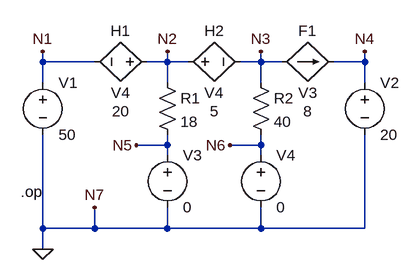
[diagram p0: schematic P_2-30.asc]
P_2-30.asc, the LTspice schematic file:
Version 4
SHEET 1 880 680
WIRE -80 96 -80 80
WIRE 0 96 -80 96
WIRE 112 96 112 80
WIRE 112 96 80 96
WIRE 144 96 112 96
WIRE 256 96 256 80
WIRE 256 96 224 96
WIRE 288 96 256 96
WIRE 416 96 416 80
WIRE 416 96 368 96
WIRE -80 128 -80 96
WIRE 112 128 112 96
WIRE 256 128 256 96
WIRE 416 128 416 96
WIRE 112 224 112 208
WIRE 112 224 64 224
WIRE 256 224 256 208
WIRE 256 224 208 224
WIRE 112 240 112 224
WIRE 256 240 256 224
WIRE -80 352 -80 208
WIRE 0 352 0 320
WIRE 0 352 -80 352
WIRE 112 352 112 320
WIRE 112 352 0 352
WIRE 256 352 256 320
WIRE 256 352 112 352
WIRE 416 352 416 208
WIRE 416 352 256 352
WIRE -80 384 -80 352
FLAG -80 80 N1
FLAG 112 80 N2
FLAG 256 80 N3
FLAG 416 80 N4
FLAG -80 384 0
FLAG 64 224 N5
FLAG 208 224 N6
FLAG 0 320 N7
SYMBOL voltage -80 112 R0
WINDOW 123 0 0 Left 2
WINDOW 39 0 0 Left 2
SYMATTR InstName V1
SYMATTR Value 50
SYMBOL h 96 96 R90
WINDOW 0 -32 56 VBottom 2
WINDOW 3 32 56 VTop 2
WINDOW 123 60 56 VTop 2
SYMATTR InstName H1
SYMATTR Value V4
SYMATTR Value2 20
SYMBOL h 128 96 M90
WINDOW 0 -32 56 VBottom 2
WINDOW 3 32 56 VTop 2
WINDOW 123 60 56 VTop 2
SYMATTR InstName H2
SYMATTR Value V4
SYMATTR Value2 5
SYMBOL f 288 96 M90
WINDOW 0 -32 40 VBottom 2
WINDOW 3 32 40 VTop 2
WINDOW 123 60 40 VTop 2
SYMATTR InstName F1
SYMATTR Value V3
SYMATTR Value2 8
SYMBOL voltage 416 112 R0
WINDOW 123 0 0 Left 2
WINDOW 39 0 0 Left 2
SYMATTR InstName V2
SYMATTR Value 20
SYMBOL res 96 112 R0
SYMATTR InstName R1
SYMATTR Value 18
SYMBOL res 240 112 R0
SYMATTR InstName R2
SYMATTR Value 40
SYMBOL voltage 112 224 R0
WINDOW 123 0 0 Left 2
WINDOW 39 0 0 Left 2
SYMATTR InstName V3
SYMATTR Value 0
SYMBOL voltage 256 224 R0
WINDOW 123 0 0 Left 2
WINDOW 39 0 0 Left 2
SYMATTR InstName V4
SYMATTR Value 0
TEXT -114 296 Left 2 !.op

The netlist it stands for:
* P_2-30.asc
V1 N1 0 50
H1 N2 N1 V4 20
H2 N2 N3 V4 5
F1 N3 N4 V3 8
V2 N4 0 20
R1 N2 N5 18
R2 N3 N6 40
V3 N5 0 0
V4 N6 0 0
.op
.backanno
.end

* Results of the author's LTspice run, read from the files saved beside the schematic
* Operating Point:
*   V(n1) = 50 V
*   V(n2) = 90 V
*   V(n3) = 80 V
*   V(n4) = 20 V
*   V(n5) = 0 V
*   V(n6) = 0 V
*   I(F1) = 40 A
*   I(H2) = 42 A
*   I(H1) = -47 A
*   I(R2) = 2 A
*   I(R1) = 5 A
*   I(V4) = 2 A
*   I(V3) = 5 A
*   I(V2) = 40 A
*   I(V1) = -47 A